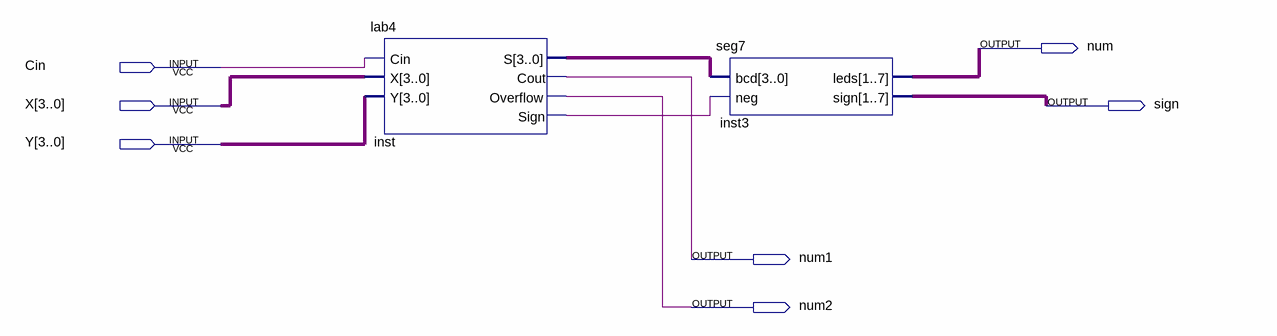
[diagram p0: schematic sheet]
// Quartus schematic lab4c.bdf as structural Verilog: 2 symbols, 7 pins
module lab4c (
  input  Cin,
  input  [3:0] X,
  input  [3:0] Y,
  output num,
  output sign,
  output num1,
  output num2
);

  wire inst_sign;
  wire [3:0] inst_s;
  wire [6:0] inst3_leds, inst3_sign;

  lab4 inst (.Cin(Cin), .X(X), .Y(Y), .S(inst_s), .Cout(num1), .Overflow(num2), .Sign(inst_sign));
  seg7 inst3 (.bcd(inst_s), .neg(inst_sign), .leds(inst3_leds), .sign(inst3_sign));
endmodule
